# Altium schematic sheet Sheet_1_2025-10-18.schdoc
size 74 x 81 mm
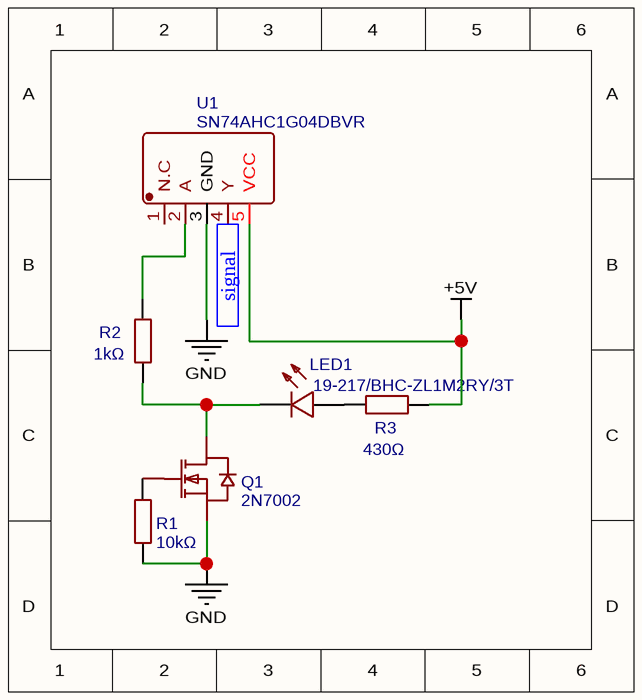
[diagram p0: Sheet_1_2025-10-18.schdoc]

## Parts
LED1  19-217/BHC-ZL1M2RY/3T  [LED0603-R-RD_BLUE]
Q1  2N7002  [SOT-23-3_L2.9-W1.3-P1.90-LS2.4-BR]
R1  10kΩ  [R0402]
R2  1kΩ  [R0402]
R3  430Ω  [R0603]
U1  SN74AHC1G04DBVR  [SOT-23-5_L3.0-W1.7-P0.95-LS2.8-BR]

## Ports
signal (in)

## Nets
+5V: R3.2 U1.5(VCC)
GND: Q1.2(S) R1.1 U1.3(GND)
signal: U1.4(Y) ; port signal
NetLED1_1: LED1.1(A) R3.1
NetLED1_2: LED1.2(C) Q1.3(D) R2.2
NetQ1_1: Q1.1(G) R1.2
NetR2_1: R2.1 U1.2(A)

Not connected (* = marked no-connect by the designer): U1 1(N.C)

## Library data of the parts
LED1 = 19-217/BHC-ZL1M2RY/3T: Manufacturer: EVERLIGHT; Supplier: LCSC; Manufacturer Part: 19-217/BHC-ZL1M2RY/3T; Supplier Part: C72041; JLCPCB Part Class: Basic Part; spicePre: L; spiceSymbolName: 19-217/BHC-ZL1M2RY/3T
Q1 = 2N7002: Manufacturer: CJ; Supplier: LCSC; Manufacturer Part: 2N7002; Supplier Part: C8545; JLCPCB Part Class: Basic Part; spicePre: Q; spiceSymbolName: 2N7002
R1 = 10kΩ: Manufacturer: UniOhm; Manufacturer Part: 0402WGF1002TCE; nameAlias: Resistance; Resistance (Ohms): 10K; Supplier: LCSC; Supplier Part: C25744; JLCPCB Part Class: Basic Part; spicePre: R; spiceSymbolName: 0402WGF1002TCE
R2 = 1kΩ: Manufacturer: UniOhm; Manufacturer Part: 0402WGF1001TCE; nameAlias: Resistance; Resistance (Ohms): 1K; Supplier: LCSC; Supplier Part: C11702; JLCPCB Part Class: Basic Part; spicePre: R; spiceSymbolName: 0402WGF1001TCE
R3 = 430Ω: Manufacturer: UniOhm; Manufacturer Part: 0603WAF4300T5E; nameAlias: Resistance; Resistance (Ohms): 430; Supplier: LCSC; Supplier Part: C23170; JLCPCB Part Class: Basic Part; spicePre: R; spiceSymbolName: 0603WAF4300T5E
U1 = SN74AHC1G04DBVR: Manufacturer: TI; Supplier: LCSC; Manufacturer Part: SN74AHC1G04DBVR; Supplier Part: C7465; JLCPCB Part Class: Extended Part; spicePre: U; spiceSymbolName: SN74AHC1G04DBVR